# Altium schematic sheet Copy of SCH Placa presentation.SchDoc
size A4; SPICEModelCacheSFJAMKIY: <root> / <DocumentId>SFJAMKIY</DocumentId> / </root>
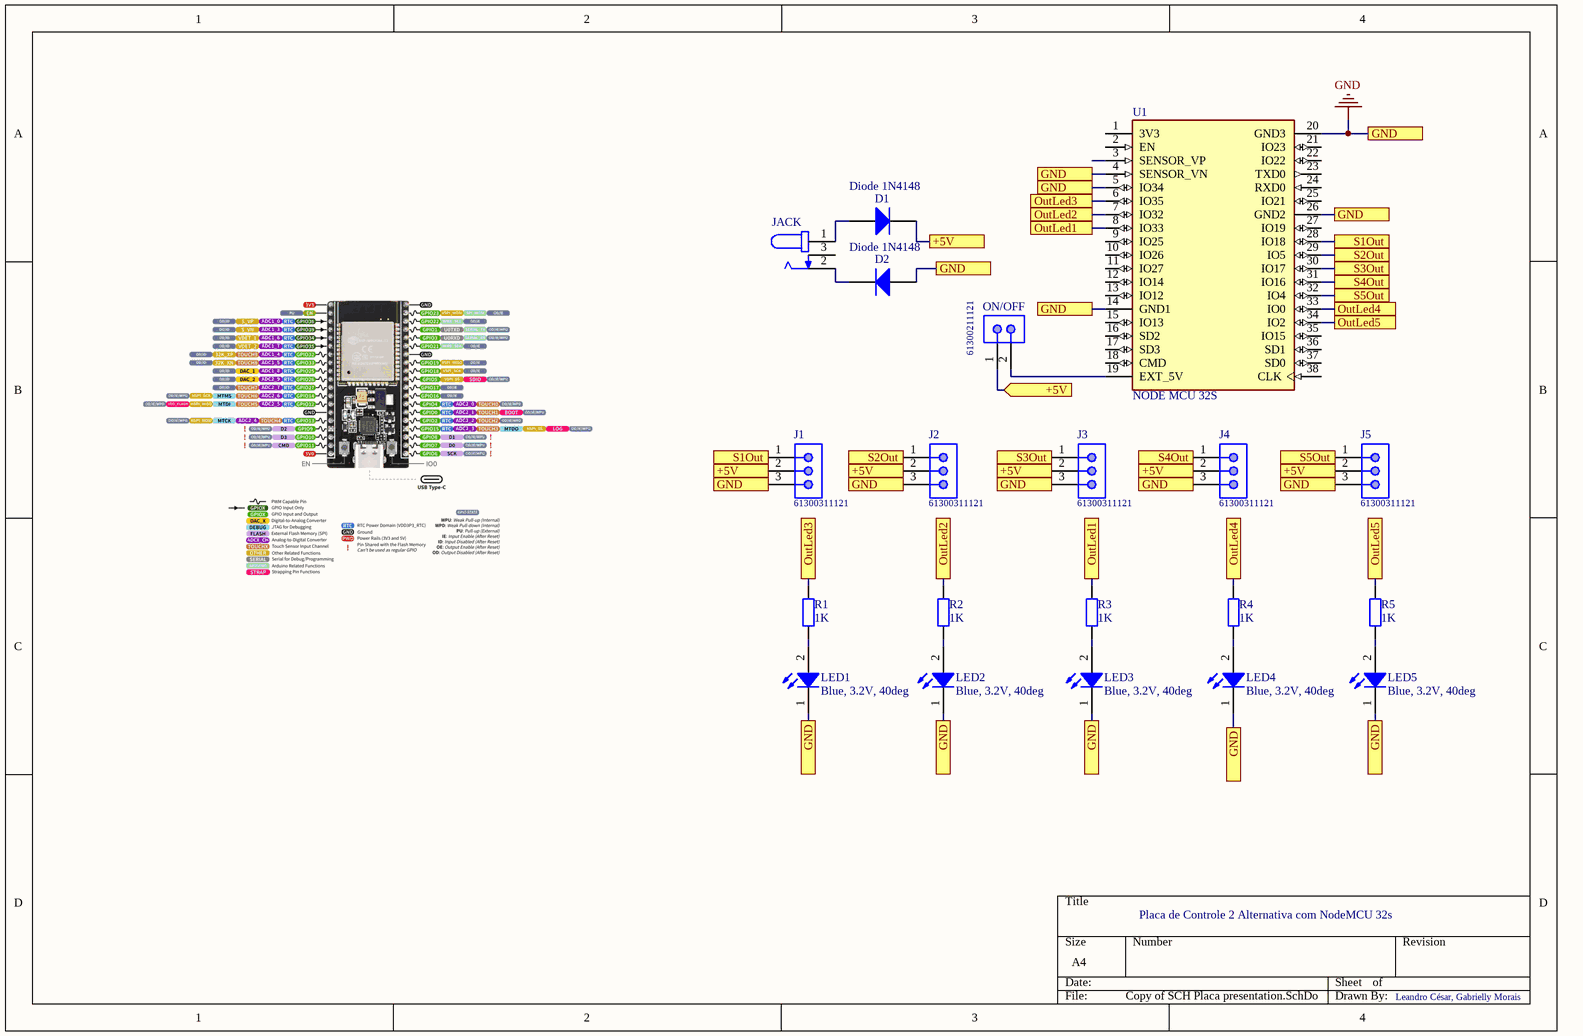
[diagram p0: Copy of SCH Placa presentation.SchDoc]

## Parts
D1  Diode 1N4148  [DO-35]
D2  Diode 1N4148  [DO-35]
J1  61300311121  [61300311121]
J2  61300311121  [61300311121]
J3  61300311121  [61300311121]
J4  61300311121  [61300311121]
J5  61300311121  [61300311121]
JACK  DCJ200-10-A-XX-K_REVA  [GCT_DCJ200-10-A-XX-K_REVA]  (value not drawn)
LED1  Blue, 3.2V, 40deg  [LED RED 3MM]
LED2  Blue, 3.2V, 40deg  [LED RED 3MM]
LED3  Blue, 3.2V, 40deg  [LED RED 3MM]
LED4  Blue, 3.2V, 40deg  [LED RED 3MM]
LED5  Blue, 3.2V, 40deg  [LED RED 3MM]
ON/OFF  61300211121  [61300211121]
R1  value 1K  [RES AXIAL-0.4]  (hidden comment: Res)
R2  value 1K  [RES AXIAL-0.4]  (hidden comment: Res)
R3  value 1K  [RES AXIAL-0.4]  (hidden comment: Res)
R4  value 1K  [RES AXIAL-0.4]  (hidden comment: Res)
R5  value 1K  [RES AXIAL-0.4]  (hidden comment: Res)
U1  NODE MCU 32S  [BOARD]

## Ports
+5V, +5V (in), GND, OutLed1, OutLed2, OutLed3, OutLed4, OutLed5, S1Out, S2Out, S3Out, S4Out, S5Out

## Nets
GND: D2.1(A) J1.3 J2.3 J3.3 J4.3 J5.3 LED1.1(K) LED2.1(K) LED3.1(K) LED4.1(K) LED5.1(K) U1.4(SENSOR_VN) U1.5(IO34) U1.14(GND1) U1.20(GND3) U1.26(GND2) ; port GND
+5V: D1.2(K) J1.2 J2.2 J3.2 J4.2 J5.2 ON/OFF.1 ; port +5V
OutLed1: R3.1 U1.8(IO33) ; port OutLed1
OutLed2: R2.1 U1.7(IO32) ; port OutLed2
OutLed3: R1.1 U1.6(IO35) ; port OutLed3
OutLed4: R4.1 U1.33(IO0) ; port OutLed4
OutLed5: R5.1 U1.34(IO2) ; port OutLed5
S1Out: J1.1 U1.28(IO18) ; port S1Out
S2Out: J2.1 U1.29(IO5) ; port S2Out
S3Out: J3.1 U1.30(IO17) ; port S3Out
S4Out: J4.1 U1.31(IO16) ; port S4Out
S5Out: J5.1 U1.32(IO4) ; port S5Out
NetD1_1: D1.1(A) JACK.1
NetD2_2: D2.2(K) JACK.2
NetLED1_2: LED1.2(A) R1.2
NetLED2_2: LED2.2(A) R2.2
NetLED3_2: LED3.2(A) R3.2
NetLED4_2: LED4.2(A) R4.2
NetLED5_2: LED5.2(A) R5.2
NetON/OFF_2: ON/OFF.2 U1.19(EXT_5V)

Not connected (* = marked no-connect by the designer): JACK 3; U1 1(3V3) 2(EN) 3(SENSOR_VP) 9(IO25) 10(IO26) 11(IO27) 12(IO14) 13(IO12) 15(IO13) 16(SD2) 17(SD3) 18(CMD) 21(IO23) 22(IO22) 23(TXD0) 24(RXD0) 25(IO21) 27(IO19) 35(IO15) 36(SD1) 37(SD0) 38(CLK)

## Notes on the sheet
- Placa de Controle 2 Alternativa com NodeMCU 32s
- Leandro César, Gabrielly Morais

## Library data of the parts
D1 D2 = Diode 1N4148: High Conductance Fast Diode; Published: 8-Jun-2000; LatestRevisionDate: 17-Jul-2002; LatestRevisionNote: Re-released for DXP Platform.; DatasheetVersion: 1997; PackageReference: DO-35; Publisher: Altium Limited; PackageDescription: Diode, Axial; Body 3.8 x 1.9 mm (LxDia. max), Lead Dia. 0.53 mm (max); Code_JEDEC: DO-204-AH; ComponentLink1Description: Manufacturer Link; ComponentLink1URL: http://www.fairchildsemi.com/; ComponentLink2Description: Datasheet; ComponentLink2URL: http://www.fairchildsemi.com/ds/1N%2F1N4148.pdf
J1-J5 = 61300311121: WR-PHD Pin Header, THT, pitch 2.54mm, Single Row, Vertical, 3pin; Pin Number: 3; Gender: Male; Rated Current: 3A; Working Voltage: 250VAC; Withstanding Voltage: 500VAC; Contact Resistance: 20mOhm; ComponentLink1Description: Manufacturer; ComponentLink1URL: http://www.we-online.de; ComponentLink2Description: Datasheet; ComponentLink2URL: https://katalog.we-online.de/em/datasheet/6130xx11121.pdf; Part Number: 61300311121; Published Date: June 2019; Publisher: Wurth Elektronik; Pitch: 2.54mm; Operating Temperature: -40 to +105degC; Mounting Technology: THT; Packaging: Bag; Row Number: Single; Orientation: Vertical
JACK = DCJ200-10-A-XX-K_REVA: Power Barrel Connector Jack 2.05mm ID (0.081), 5.50mm OD (0.217) Through Hole, Right Angle; MF: Global Connector Technology; MP: DCJ200-10-A-K1-K; SnapEDA_Link: https://www.snapeda.com/parts/DCJ200-10-A-K1-K/Global+Connector+Technology/view-part/?ref=snap; Package: None; Value: *; Check_prices: https://www.snapeda.com/parts/DCJ200-10-A-K1-K/Global+Connector+Technology/view-part/?ref=eda
LED1-LED5 = LED: LED WL-TMRC THT Mono-color Round; Part Number: 151051BS04000; Luminous Intensity: 500mcd; Dominant Wavelength: 470nm; Peak Wavelength: 465nm; Chip Technology: GaN; ComponentLink1Description: Manufacturer; ComponentLink1URL: http://www.we-online.de; ComponentLink2Description: Datasheet; ComponentLink2URL: https://katalog.we-online.de/led/datasheet/151051BS04000.pdf; Emitting Color: Blue; Operating Temperature: -40 to +85degC; Mounting Technology: THT; Forward Voltage: 3.2V; Packaging: Bulk; Published Date: October 2019; Publisher: Wurth Elektronik; Size: 5mm; Viewing Angle: 40deg
ON/OFF = 61300211121: WR-PHD Pin Header, THT, pitch 2.54mm, Single Row, Vertical, 2pin; Pin Number: 2; Gender: Male; Rated Current: 3A; Working Voltage: 250VAC; Withstanding Voltage: 500VAC; Contact Resistance: 20mOhm; ComponentLink1Description: Manufacturer; ComponentLink1URL: http://www.we-online.de; ComponentLink2Description: Datasheet; ComponentLink2URL: https://katalog.we-online.de/em/datasheet/6130xx11121.pdf; Part Number: 61300211121; Published Date: June 2019; Publisher: Wurth Elektronik; Pitch: 2.54mm; Operating Temperature: -40 to +105degC; Mounting Technology: THT; Packaging: Bag; Row Number: Single; Orientation: Vertical
R1-R5 = Res: Resistor; Published: 8-Jun-2000; LatestRevisionDate: 17-Jul-2002; LatestRevisionNote: Re-released for DXP Platform.; PackageReference: AXIAL-0.4; Publisher: Altium Limited; PackageDescription: Axial Device, Thru-Hole; 2 Leads; 0.4 in Pin Spacing
U1 = NODE MCU 32S: MP: ESP32-DEVKITC-32D; MF: Espressif Systems; Value: *; Price: None; Check_prices: https://www.snapeda.com/parts/ESP32-DEVKITC-32D/Espressif%20Systems/view-part/2777395/?ref=eda; SnapEDA_Link: https://www.snapeda.com/parts/ESP32-DEVKITC-32D/Espressif%20Systems/view-part/2777395/?ref=snap; Availability: Warning; Purchase-URL: https://pricing.snapeda.com/search/part/ESP32-DEVKITC-32D/?ref=eda; Package: None